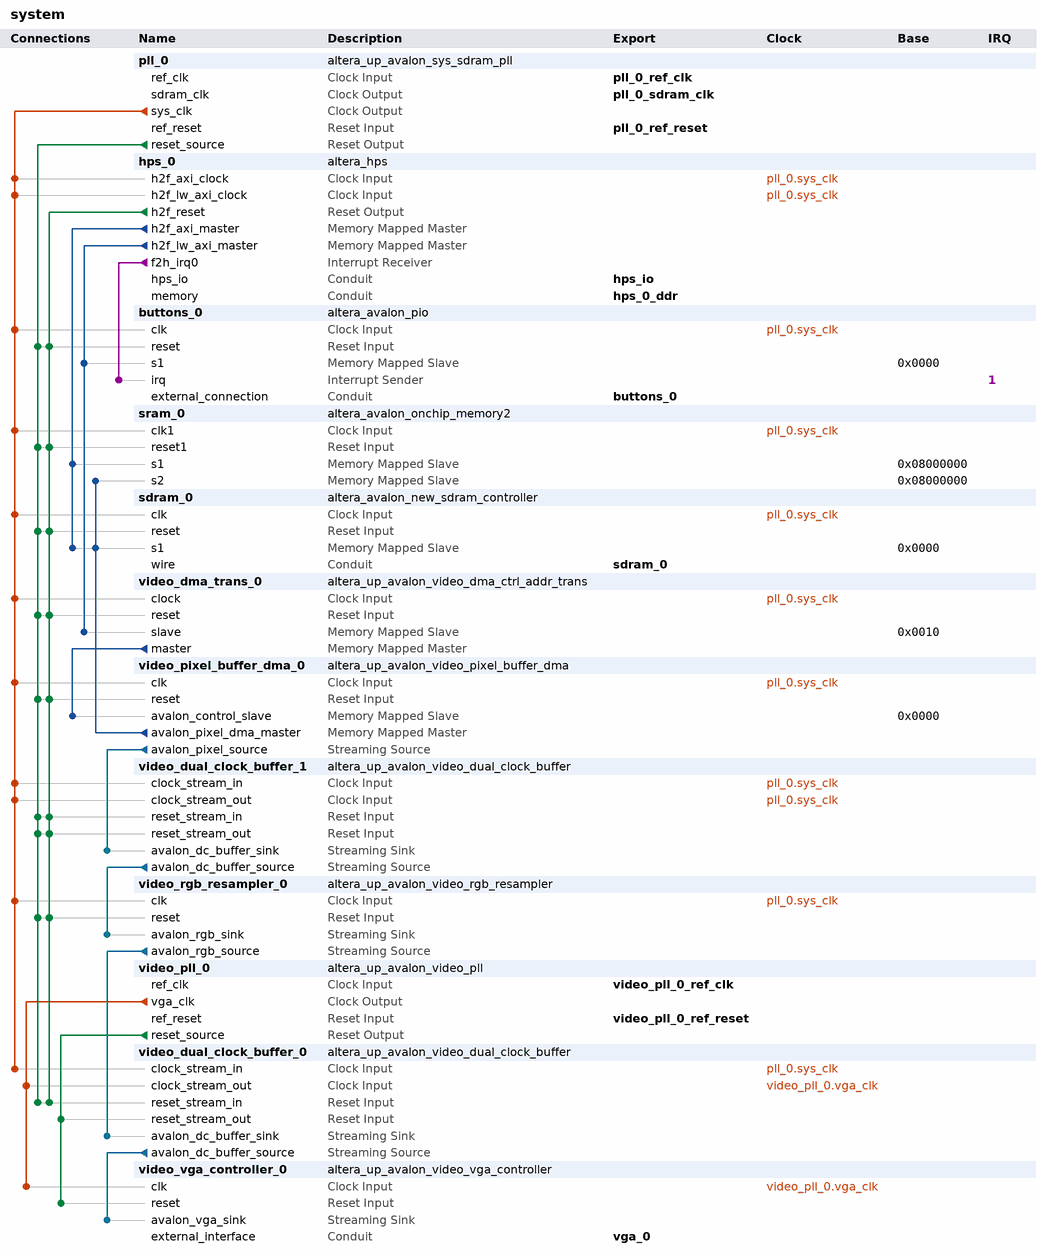
[diagram p0: system contents]
# Platform Designer (Qsys) system system, Cyclone V 5CSEMA5F31C6
# Parameters at their usual value, and those the tool derives, are not listed.
package require -exact qsys 18.0
create_system system
set_project_property DEVICE_FAMILY {Cyclone V}
set_project_property DEVICE 5CSEMA5F31C6

add_instance pll_0 altera_up_avalon_sys_sdram_pll 18.0
set_instance_parameter_value pll_0 CV_boards DE1-SoC
set_instance_parameter_value pll_0 gui_outclk 100.0
set_instance_parameter_value pll_0 gui_refclk 50.0

add_instance hps_0 altera_hps 19.1
set_instance_parameter_value hps_0 EMAC1_Mode RGMII
set_instance_parameter_value hps_0 EMAC1_PinMuxing {HPS I/O Set 0}
set_instance_parameter_value hps_0 F2SCLK_COLDRST_Enable false
set_instance_parameter_value hps_0 F2SCLK_DBGRST_Enable false
set_instance_parameter_value hps_0 F2SCLK_WARMRST_Enable false
set_instance_parameter_value hps_0 F2SINTERRUPT_Enable true
set_instance_parameter_value hps_0 F2S_Width 0
set_instance_parameter_value hps_0 FPGA_PERIPHERAL_OUTPUT_CLOCK_FREQ_EMAC0_GTX_CLK 125
set_instance_parameter_value hps_0 FPGA_PERIPHERAL_OUTPUT_CLOCK_FREQ_EMAC0_MD_CLK 2.5
set_instance_parameter_value hps_0 FPGA_PERIPHERAL_OUTPUT_CLOCK_FREQ_EMAC1_GTX_CLK 125
set_instance_parameter_value hps_0 FPGA_PERIPHERAL_OUTPUT_CLOCK_FREQ_EMAC1_MD_CLK 2.5
set_instance_parameter_value hps_0 HPS_PROTOCOL DDR3
set_instance_parameter_value hps_0 I2C0_Mode N/A
set_instance_parameter_value hps_0 I2C0_PinMuxing Unused
set_instance_parameter_value hps_0 I2C1_Mode N/A
set_instance_parameter_value hps_0 I2C1_PinMuxing Unused
set_instance_parameter_value hps_0 LWH2F_Enable true
set_instance_parameter_value hps_0 MEM_BANKADDR_WIDTH 3
set_instance_parameter_value hps_0 MEM_CLK_FREQ 400.0
set_instance_parameter_value hps_0 MEM_COL_ADDR_WIDTH 10
set_instance_parameter_value hps_0 MEM_DQ_WIDTH 32
set_instance_parameter_value hps_0 MEM_DRV_STR RZQ/7
set_instance_parameter_value hps_0 MEM_ROW_ADDR_WIDTH 15
set_instance_parameter_value hps_0 MEM_RTT_NOM RZQ/4
set_instance_parameter_value hps_0 MEM_RTT_WR RZQ/4
set_instance_parameter_value hps_0 MEM_TCL 11
set_instance_parameter_value hps_0 MEM_TFAW_NS 30.0
set_instance_parameter_value hps_0 MEM_TRAS_NS 35.0
set_instance_parameter_value hps_0 MEM_TRCD_NS 13.75
set_instance_parameter_value hps_0 MEM_TRFC_NS 260.0
set_instance_parameter_value hps_0 MEM_TRP_NS 13.75
set_instance_parameter_value hps_0 MEM_VENDOR Other
set_instance_parameter_value hps_0 MEM_WTCL 8
set_instance_parameter_value hps_0 QSPI_Mode N/A
set_instance_parameter_value hps_0 QSPI_PinMuxing Unused
set_instance_parameter_value hps_0 REF_CLK_FREQ 25.0
set_instance_parameter_value hps_0 S2FCLK_USER2CLK 5
set_instance_parameter_value hps_0 S2F_Width 3
set_instance_parameter_value hps_0 SDIO_Mode {4-bit Data}
set_instance_parameter_value hps_0 SDIO_PinMuxing {HPS I/O Set 0}
set_instance_parameter_value hps_0 SPIM1_Mode N/A
set_instance_parameter_value hps_0 SPIM1_PinMuxing Unused
set_instance_parameter_value hps_0 STM_Enable false
set_instance_parameter_value hps_0 TIMING_BOARD_AC_SKEW 0.02
set_instance_parameter_value hps_0 TIMING_BOARD_AC_TO_CK_SKEW 0.01
set_instance_parameter_value hps_0 TIMING_BOARD_DQ_TO_DQS_SKEW 0.05
set_instance_parameter_value hps_0 TIMING_BOARD_MAX_CK_DELAY 0.03
set_instance_parameter_value hps_0 TIMING_BOARD_MAX_DQS_DELAY 0.02
set_instance_parameter_value hps_0 TIMING_BOARD_SKEW_BETWEEN_DQS 0.06
set_instance_parameter_value hps_0 TIMING_BOARD_SKEW_CKDQS_DIMM_MAX 0.12
set_instance_parameter_value hps_0 TIMING_BOARD_SKEW_CKDQS_DIMM_MIN 0.06
set_instance_parameter_value hps_0 TIMING_BOARD_SKEW_WITHIN_DQS 0.01
set_instance_parameter_value hps_0 TIMING_TDH 65
set_instance_parameter_value hps_0 TIMING_TDQSCK 255
set_instance_parameter_value hps_0 TIMING_TDQSQ 125
set_instance_parameter_value hps_0 TIMING_TDS 30
set_instance_parameter_value hps_0 TIMING_TIH 140
set_instance_parameter_value hps_0 TIMING_TIS 180
set_instance_parameter_value hps_0 TIMING_TQSH 0.4
set_instance_parameter_value hps_0 UART0_Mode {No Flow Control}
set_instance_parameter_value hps_0 UART0_PinMuxing {HPS I/O Set 0}
set_instance_parameter_value hps_0 USB1_Mode SDR
set_instance_parameter_value hps_0 USB1_PinMuxing {HPS I/O Set 0}
set_instance_parameter_value hps_0 desired_cfg_clk_mhz 100.0
set_instance_parameter_value hps_0 desired_qspi_clk_mhz 400.0

add_instance buttons_0 altera_avalon_pio 19.1
set_instance_parameter_value buttons_0 bitClearingEdgeCapReg true
set_instance_parameter_value buttons_0 captureEdge true
set_instance_parameter_value buttons_0 direction Input
set_instance_parameter_value buttons_0 edgeType FALLING
set_instance_parameter_value buttons_0 generateIRQ true
set_instance_parameter_value buttons_0 simDoTestBenchWiring true
set_instance_parameter_value buttons_0 width 4

add_instance sram_0 altera_avalon_onchip_memory2 19.1
set_instance_parameter_value sram_0 dataWidth 32
set_instance_parameter_value sram_0 dualPort true
set_instance_parameter_value sram_0 initMemContent true
set_instance_parameter_value sram_0 initializationFileName onchip_mem.hex
set_instance_parameter_value sram_0 memorySize 262144
set_instance_parameter_value sram_0 singleClockOperation true

add_instance sdram_0 altera_avalon_new_sdram_controller 19.1
set_instance_parameter_value sdram_0 TAC 5.5
set_instance_parameter_value sdram_0 TRCD 20.0
set_instance_parameter_value sdram_0 TRP 20.0
set_instance_parameter_value sdram_0 casLatency 3
set_instance_parameter_value sdram_0 columnWidth 10
set_instance_parameter_value sdram_0 dataWidth 16
set_instance_parameter_value sdram_0 generateSimulationModel true
set_instance_parameter_value sdram_0 model single_Micron_MT48LC4M32B2_7_chip
set_instance_parameter_value sdram_0 numberOfBanks 4
set_instance_parameter_value sdram_0 numberOfChipSelects 1
set_instance_parameter_value sdram_0 powerUpDelay 100.0
set_instance_parameter_value sdram_0 refreshPeriod 15.625
set_instance_parameter_value sdram_0 rowWidth 13

add_instance video_dma_trans_0 altera_up_avalon_video_dma_ctrl_addr_trans 18.0

add_instance video_pixel_buffer_dma_0 altera_up_avalon_video_pixel_buffer_dma 18.0
set_instance_parameter_value video_pixel_buffer_dma_0 addr_mode X-Y
set_instance_parameter_value video_pixel_buffer_dma_0 back_start_address 134217728
set_instance_parameter_value video_pixel_buffer_dma_0 color_space {8-bit RGB}
set_instance_parameter_value video_pixel_buffer_dma_0 image_height 480
set_instance_parameter_value video_pixel_buffer_dma_0 image_width 640
set_instance_parameter_value video_pixel_buffer_dma_0 start_address 134217728

add_instance video_dual_clock_buffer_1 altera_up_avalon_video_dual_clock_buffer 18.0
set_instance_parameter_value video_dual_clock_buffer_1 color_bits 8
set_instance_parameter_value video_dual_clock_buffer_1 color_planes 1

add_instance video_rgb_resampler_0 altera_up_avalon_video_rgb_resampler 18.0
set_instance_parameter_value video_rgb_resampler_0 alpha 1023
set_instance_parameter_value video_rgb_resampler_0 input_type {8-bit RGB}
set_instance_parameter_value video_rgb_resampler_0 output_type {30-bit RGB}

add_instance video_pll_0 altera_up_avalon_video_pll 18.0
set_instance_parameter_value video_pll_0 camera {5MP Digital Camera (THDB_D5M)}
set_instance_parameter_value video_pll_0 gui_refclk 50.0
set_instance_parameter_value video_pll_0 lcd {7" LCD on VEEK-MT and MTL/MTL2 Modules}

add_instance video_dual_clock_buffer_0 altera_up_avalon_video_dual_clock_buffer 18.0
set_instance_parameter_value video_dual_clock_buffer_0 color_bits 10

add_instance video_vga_controller_0 altera_up_avalon_video_vga_controller 18.0
set_instance_parameter_value video_vga_controller_0 board DE1-SoC
set_instance_parameter_value video_vga_controller_0 resolution {VGA 640x480}

# connections
add_connection pll_0.sys_clk buttons_0.clk clock
add_connection pll_0.sys_clk hps_0.h2f_axi_clock clock
add_connection pll_0.sys_clk hps_0.h2f_lw_axi_clock clock
add_connection pll_0.sys_clk sdram_0.clk clock
add_connection pll_0.sys_clk sram_0.clk1 clock
add_connection pll_0.sys_clk video_dma_trans_0.clock clock
add_connection pll_0.sys_clk video_dual_clock_buffer_0.clock_stream_in clock
add_connection pll_0.sys_clk video_dual_clock_buffer_1.clock_stream_in clock
add_connection pll_0.sys_clk video_dual_clock_buffer_1.clock_stream_out clock
add_connection pll_0.sys_clk video_pixel_buffer_dma_0.clk clock
add_connection pll_0.sys_clk video_rgb_resampler_0.clk clock
add_connection video_pll_0.vga_clk video_dual_clock_buffer_0.clock_stream_out clock
add_connection video_pll_0.vga_clk video_vga_controller_0.clk clock
add_connection hps_0.h2f_reset buttons_0.reset reset
add_connection hps_0.h2f_reset sdram_0.reset reset
add_connection hps_0.h2f_reset sram_0.reset1 reset
add_connection hps_0.h2f_reset video_dma_trans_0.reset reset
add_connection hps_0.h2f_reset video_dual_clock_buffer_0.reset_stream_in reset
add_connection hps_0.h2f_reset video_dual_clock_buffer_1.reset_stream_in reset
add_connection hps_0.h2f_reset video_dual_clock_buffer_1.reset_stream_out reset
add_connection hps_0.h2f_reset video_pixel_buffer_dma_0.reset reset
add_connection hps_0.h2f_reset video_rgb_resampler_0.reset reset
add_connection pll_0.reset_source buttons_0.reset reset
add_connection pll_0.reset_source sdram_0.reset reset
add_connection pll_0.reset_source sram_0.reset1 reset
add_connection pll_0.reset_source video_dma_trans_0.reset reset
add_connection pll_0.reset_source video_dual_clock_buffer_0.reset_stream_in reset
add_connection pll_0.reset_source video_dual_clock_buffer_1.reset_stream_in reset
add_connection pll_0.reset_source video_dual_clock_buffer_1.reset_stream_out reset
add_connection pll_0.reset_source video_pixel_buffer_dma_0.reset reset
add_connection pll_0.reset_source video_rgb_resampler_0.reset reset
add_connection video_pll_0.reset_source video_dual_clock_buffer_0.reset_stream_out reset
add_connection video_pll_0.reset_source video_vga_controller_0.reset reset
add_connection hps_0.h2f_axi_master sdram_0.s1 avalon
set_connection_parameter_value hps_0.h2f_axi_master/sdram_0.s1 baseAddress 0x0000
add_connection hps_0.h2f_axi_master sram_0.s1 avalon
set_connection_parameter_value hps_0.h2f_axi_master/sram_0.s1 baseAddress 0x08000000
add_connection hps_0.h2f_lw_axi_master buttons_0.s1 avalon
set_connection_parameter_value hps_0.h2f_lw_axi_master/buttons_0.s1 baseAddress 0x0000
add_connection hps_0.h2f_lw_axi_master video_dma_trans_0.slave avalon
set_connection_parameter_value hps_0.h2f_lw_axi_master/video_dma_trans_0.slave baseAddress 0x0010
add_connection video_dma_trans_0.master video_pixel_buffer_dma_0.avalon_control_slave avalon
set_connection_parameter_value video_dma_trans_0.master/video_pixel_buffer_dma_0.avalon_control_slave baseAddress 0x0000
add_connection video_pixel_buffer_dma_0.avalon_pixel_dma_master sdram_0.s1 avalon
set_connection_parameter_value video_pixel_buffer_dma_0.avalon_pixel_dma_master/sdram_0.s1 baseAddress 0x0000
add_connection video_pixel_buffer_dma_0.avalon_pixel_dma_master sram_0.s2 avalon
set_connection_parameter_value video_pixel_buffer_dma_0.avalon_pixel_dma_master/sram_0.s2 baseAddress 0x08000000
add_connection video_dual_clock_buffer_0.avalon_dc_buffer_source video_vga_controller_0.avalon_vga_sink avalon_streaming
add_connection video_dual_clock_buffer_1.avalon_dc_buffer_source video_rgb_resampler_0.avalon_rgb_sink avalon_streaming
add_connection video_pixel_buffer_dma_0.avalon_pixel_source video_dual_clock_buffer_1.avalon_dc_buffer_sink avalon_streaming
add_connection video_rgb_resampler_0.avalon_rgb_source video_dual_clock_buffer_0.avalon_dc_buffer_sink avalon_streaming
add_connection hps_0.f2h_irq0 buttons_0.irq interrupt
set_connection_parameter_value hps_0.f2h_irq0/buttons_0.irq irqNumber 1

# exported interfaces
add_interface buttons_0 conduit end
set_interface_property buttons_0 EXPORT_OF buttons_0.external_connection
add_interface hps_0_ddr conduit end
set_interface_property hps_0_ddr EXPORT_OF hps_0.memory
add_interface hps_io conduit end
set_interface_property hps_io EXPORT_OF hps_0.hps_io
add_interface pll_0_ref_clk clock sink
set_interface_property pll_0_ref_clk EXPORT_OF pll_0.ref_clk
add_interface pll_0_ref_reset reset sink
set_interface_property pll_0_ref_reset EXPORT_OF pll_0.ref_reset
add_interface pll_0_sdram_clk clock source
set_interface_property pll_0_sdram_clk EXPORT_OF pll_0.sdram_clk
add_interface sdram_0 conduit end
set_interface_property sdram_0 EXPORT_OF sdram_0.wire
add_interface vga_0 conduit end
set_interface_property vga_0 EXPORT_OF video_vga_controller_0.external_interface
add_interface video_pll_0_ref_clk clock sink
set_interface_property video_pll_0_ref_clk EXPORT_OF video_pll_0.ref_clk
add_interface video_pll_0_ref_reset reset sink
set_interface_property video_pll_0_ref_reset EXPORT_OF video_pll_0.ref_reset

set_interconnect_requirement {$system} qsys_mm.clockCrossingAdapter HANDSHAKE
set_interconnect_requirement {$system} qsys_mm.enableEccProtection FALSE
set_interconnect_requirement {$system} qsys_mm.insertDefaultSlave FALSE
set_interconnect_requirement {$system} qsys_mm.maxAdditionalLatency 1

save_system system.qsys
